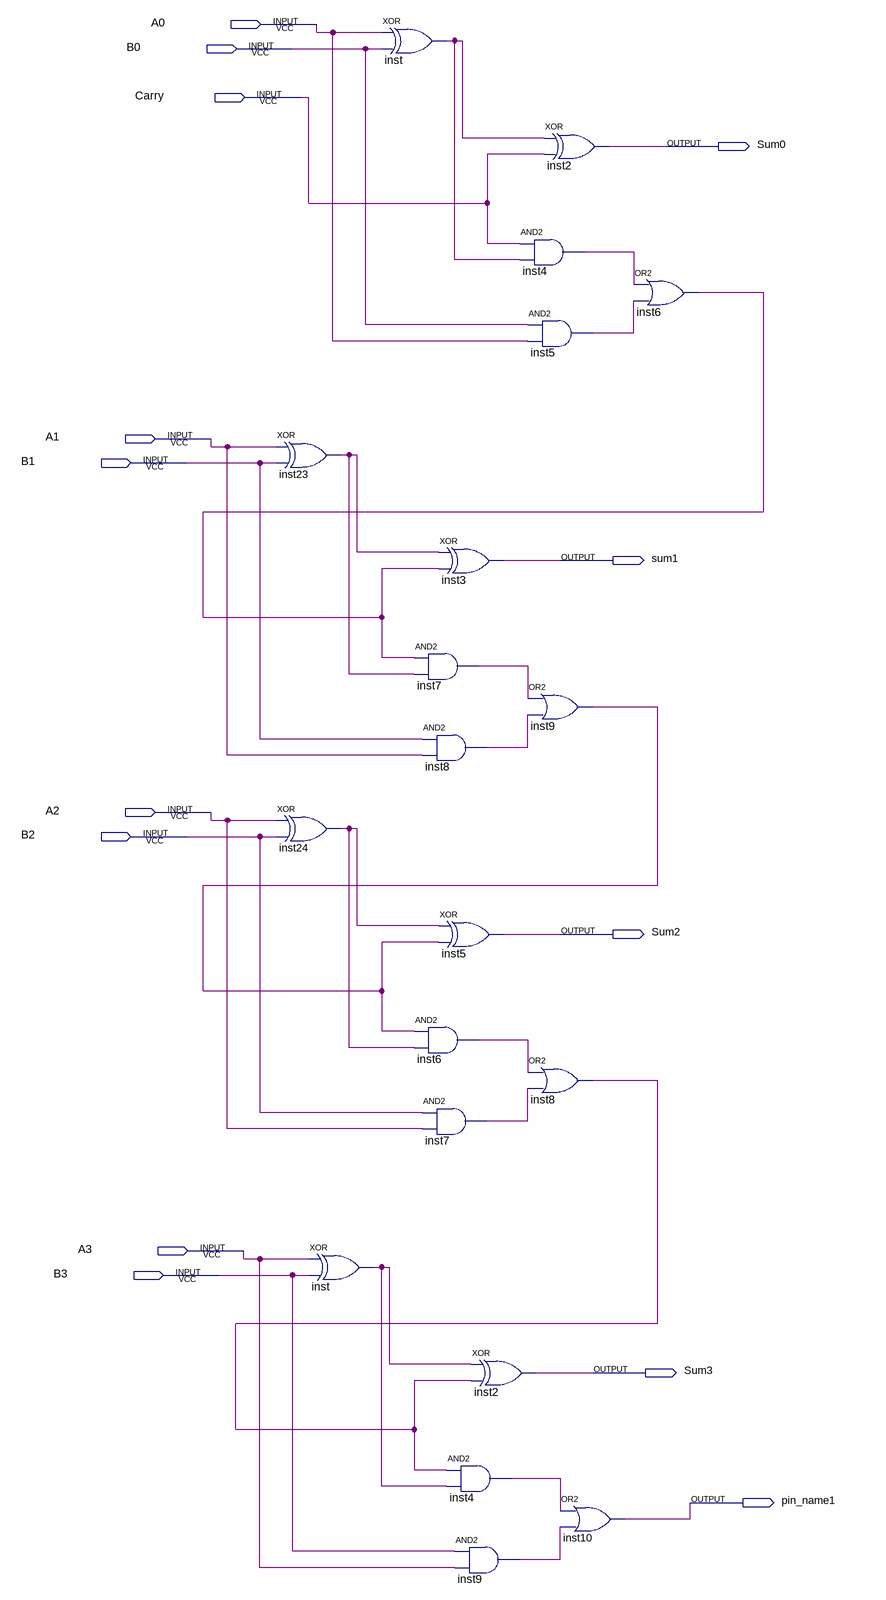
[diagram p0: schematic sheet]
// Quartus schematic 2 bit adder.bdf as structural Verilog: 20 symbols, 14 pins
module \2_bit_adder  (
  input  A0,
  input  B0,
  input  Carry,
  input  A1,
  input  B1,
  input  A2,
  input  B2,
  input  A3,
  input  B3,
  output Sum0,
  output sum1,
  output Sum2,
  output Sum3,
  output pin_name1
);

  wire inst4_out, inst4_out_2, inst5_out, inst6_out, inst6_out_2, inst7_out, inst7_out_2, inst8_out,
       inst8_out_2, inst9_out, inst9_out_2, inst23_out, inst24_out, inst_out, inst_out_2;

  xor inst23 (inst23_out, A1, B1);
  xor inst24 (inst24_out, A2, B2);
  xor inst (inst_out_2, A3, B3);
  xor inst_dup2 (inst_out, A0, B0);
  xor inst3 (sum1, inst23_out, inst6_out);
  and inst7 (inst7_out, inst6_out, inst23_out);
  and inst8 (inst8_out, B1, A1);
  xor inst5 (Sum2, inst24_out, inst9_out);
  and inst6 (inst6_out_2, inst9_out, inst24_out);
  and inst7_dup2 (inst7_out_2, B2, A2);
  and inst4 (inst4_out_2, inst8_out_2, inst_out_2);
  and inst9 (inst9_out_2, B3, A3);
  and inst4_dup2 (inst4_out, Carry, inst_out);
  xor inst2 (Sum3, inst_out_2, inst8_out_2);
  xor inst2_dup2 (Sum0, inst_out, Carry);
  and inst5_dup2 (inst5_out, B0, A0);
  or inst9_dup2 (inst9_out, inst7_out, inst8_out);
  or inst8_dup2 (inst8_out_2, inst6_out_2, inst7_out_2);
  or inst10 (pin_name1, inst4_out_2, inst9_out_2);
  or inst6_dup2 (inst6_out, inst4_out, inst5_out);
endmodule
